# EAGLE design slave_relais (EAGLE 7.7.0)
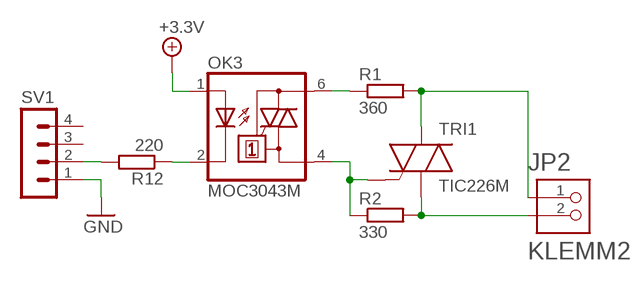
[diagram p0: schematic, sheet 1]

## Parts
JP2  KLEMM2  [KLEMM2]
OK3  MOC3043M  [DIL06]
R1  360  R-EU_0204/7  [0204/7]
R2  330  R-EU_0204/7  [0204/7]
R12  220  R-EU_0207/12  [0207/12]
SV1  MA04-1  [MA04-1]
TRI1  TIC226M  [TO-220A]

## Nets
+5V: OK3.1(A) ; supply symbol labelled +3.3V
GND: SV1.1
N$1: JP2.2 R2.2 TRI1.1(A1)
N$2: R12.2 SV1.2
N$3: JP2.1 R1.2 TRI1.2(A2)
N$6: OK3.4(A1) R2.1 TRI1.3(G)
N$8: OK3.6(A2) R1.1
N$9: OK3.2(C) R12.1
Unconnected: SV1.3 SV1.4

## Library data of the parts
JP2 = PINHEAD:KLEMM2
OK3 = optocoupler:MOC30*: 6-Pin DIP Zero-Cross Optoisolators Triac Driver Output (250/400 Volt Peak) Source: Data sheet <http://www.fairchildsemi.com/ds/MO/MOC3031M.pdf> The old path of data sheet not more available 2013-05-06.; MF: FAIRCHILD SEMICONDUCTOR; MPN: MOC3043-M; OC_FARNELL: 1021371; OC_NEWARK: 72K8900
R1 R2 R12 = resistor:R-EU_: RESISTOR, European symbol
SV1 = con-lstb:MA04-1: PIN HEADER; OC_FARNELL: unknown; OC_NEWARK: unknown
TRI1 = SEMICON:TIC226M

## Board
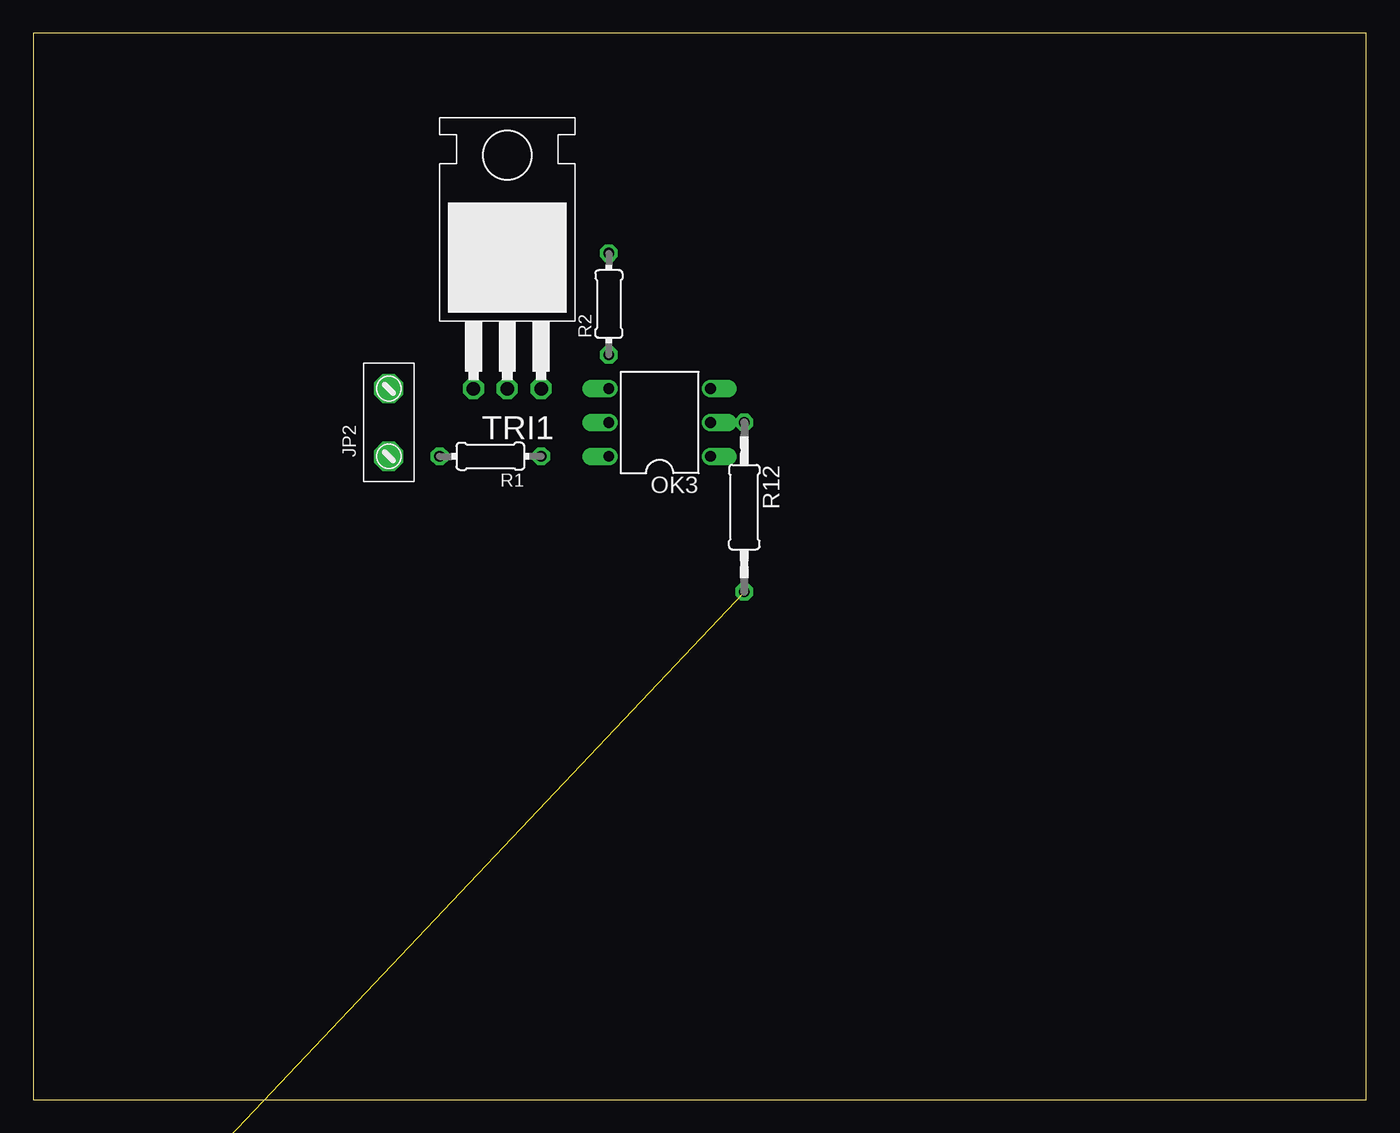
[diagram p1: board, top side]
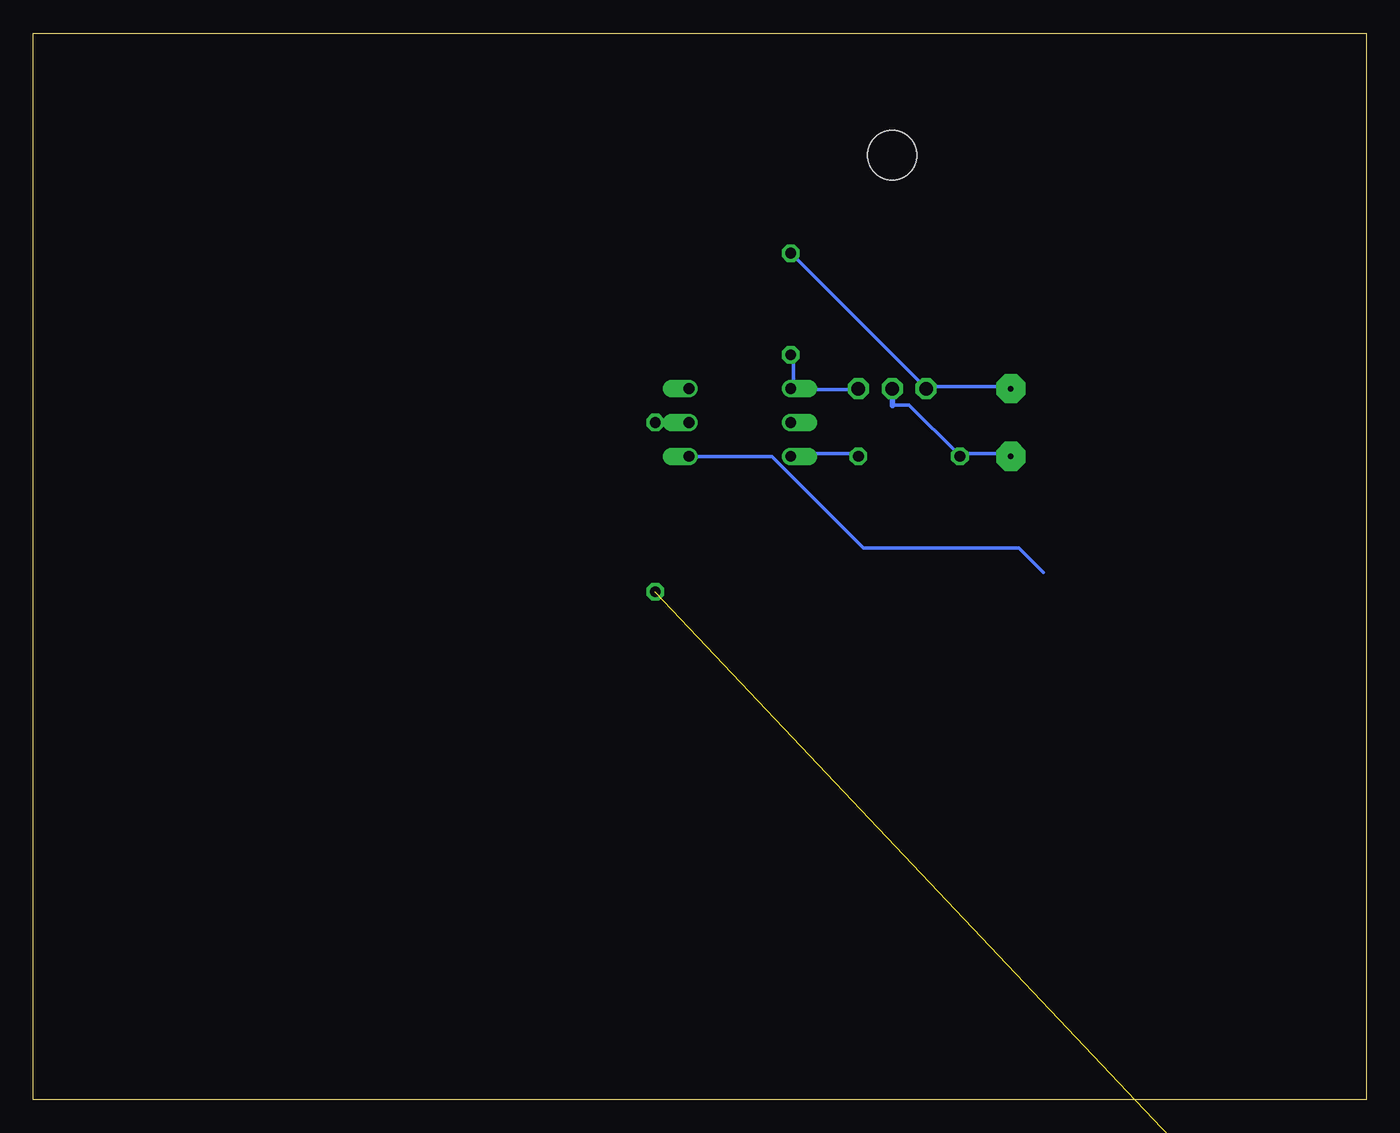
[diagram p2: board, bottom side, seen from below]

Size 100 x 80 mm. Coordinates in mm from the lower left corner, seen from the top.
Outline: 0,0 100,0 100,80 0,80 0,0
Copper layers (1*16): Top 0.035mm / dielectric 1.5mm / Bottom 0.035mm
Design rules "default": minimum track width 10mil, minimum drill 24mil, track to track 8mil, track to pad 8mil, pad to pad 8mil, via to via 8mil, smd to smd 8mil, copper to edge 40mil, drill to drill 8mil, minimum pad ring 10mil, minimum via ring 8mil, stop-mask expansion 4mil, vias tented up to drill 0mil, thermal gap 10mil

### Footprints (pad centres in the part's own frame; a part is rotated, then mirrored left to right if it is on the bottom)
KLEMM2 = drill 0.406 pad 2.184 octagon: 1 -2.54,0; 2 2.54,0
DIL06 = drill 0.813 offset: 1 -2.54,-3.81; 2 0,-3.81; 3 2.54,-3.81; 4 2.54,3.81; 5 0,3.81; 6 -2.54,3.81
0204/7 = drill 0.813 octagon: 1 -3.81,0; 2 3.81,0
0207/12 = drill 0.813 octagon: 1 -6.35,0; 2 6.35,0
MA04-1 = drill 1.016 long: 1 -3.81,0; 2 -1.27,0; 3 1.27,0; 4 3.81,0
TO-220A = drill 1.016 pad 1.575 octagon: 1 -2.54,-10.16; 2 0,-10.16; 3 2.54,-10.16 | hole 3.708: 0,7.366

### Placement (x,y rotation side)
JP2  26.67,50.8 90 top
OK3  46.99,50.8 90 top
R1  34.29,48.26 180 top
R2  43.18,59.69 90 top
R12  53.34,44.45 270 top
SV1  11.43,-7.62 0 top  (outside the outline)
TRI1  35.56,63.5 0 top

### Tracks (layer width: path | path; a pad name or v marks a point on that pad's centre or on a via)
+5V
  Bottom 0.254: 24.23,39.55 26.06,41.38 37.72,41.38 44.58,48.23 50.75,48.23 OK3.1
N$1
  Bottom 0.254: R2.2 42.98,63.32 33.15,53.49 TRI1.1 32.92,53.49 26.75,53.49 JP2.2
N$2  (1 unrouted)
N$3
  Bottom 0.254: JP2.1 26.75,48.46 30.4,48.46 R1.2 30.63,48.46 34.29,52.12 35.56,52.12
  Bottom 0.406: 35.56,52.07 35.56,52.12 TRI1.2
N$6
  Bottom 0.254: R2.1 42.98,55.78 42.98,53.49 OK3.4 42.98,53.26 38.18,53.26 TRI1.3
N$8
  Bottom 0.254: R1.1 38.18,48.46 42.98,48.46 OK3.6
N$9
  Bottom 0.254: OK3.2 50.98,50.98 53.26,50.98 R12.1